# Altium schematic sheet 4Z.SchDoc
size A4
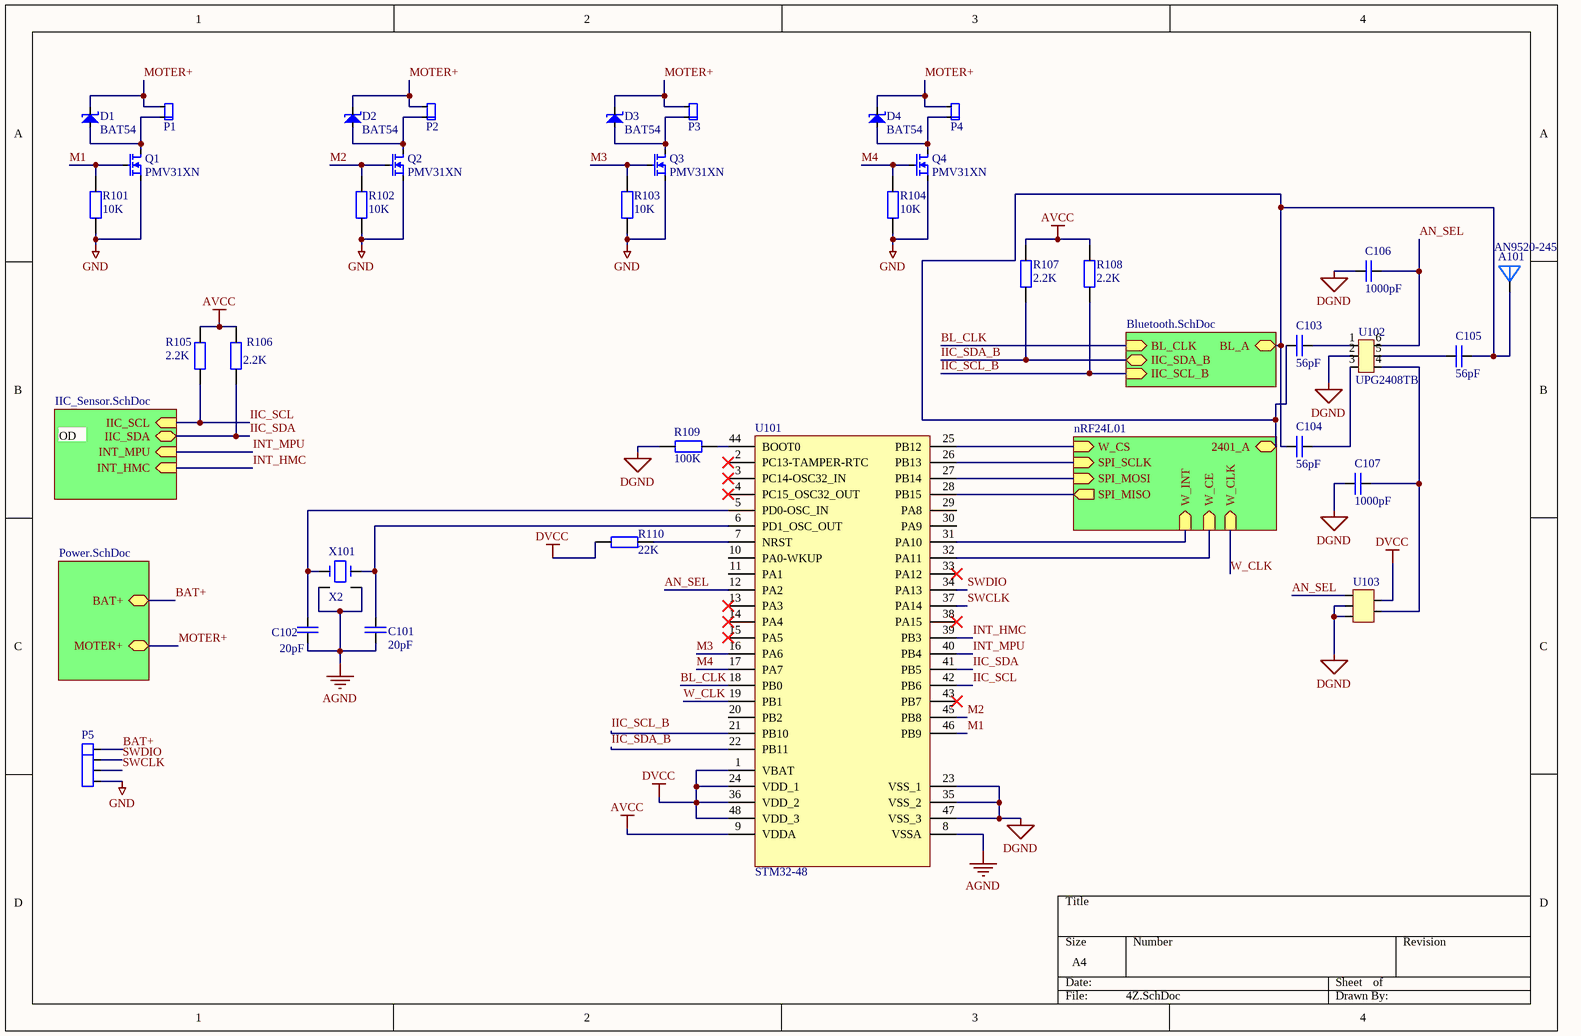
[diagram p0: 4Z.SchDoc]

## Parts
A101  AN9520-245  [AN9520-245]
C101  20pF  [0603]
C102  20pF  [0603]
C103  56pF  [0603]
C104  56pF  [0603]
C105  56pF  [0603]
C106  1000pF  [0603]
C107  1000pF  [0603]
D1  BAT54  [BAT54]
D2  BAT54  [BAT54]
D3  BAT54  [BAT54]
D4  BAT54  [BAT54]
P1  DIP_2  [PAD_M]  (value not drawn)
P2  DIP_2  [PAD_M]  (value not drawn)
P3  DIP_2  [PAD_M]  (value not drawn)
P4  DIP_2  [PAD_M]  (value not drawn)
P5  DIP_4  [DIP_4]  (value not drawn)
Q1  PMV31XN  [PMV31XN]
Q2  PMV31XN  [PMV31XN]
Q3  PMV31XN  [PMV31XN]
Q4  PMV31XN  [PMV31XN]
R101  10K  [0603]
R102  10K  [0603]
R103  10K  [0603]
R104  10K  [0603]
R105  2.2K  [0603]
R106  2.2K  [0603]
R107  2.2K  [0603]
R108  2.2K  [0603]
R109  100K  [0603]
R110  22K  [0603]
U101  STM32-48  [STM32-48]
U102  UPG2408TB  [UPF2408TB]
U103  SN74LVC1G02DBVR  [SN74LVC1G02DBVR]  (value not drawn)
X101  X2  [3225]

## Sub-sheets
Bluetooth = Bluetooth.SchDoc: IIC_SCL_B (in), IIC_SDA_B (bidir), BL_CLK (in), BL_A
IIC_Sensor = IIC_Sensor.SchDoc: IIC_SCL (in), IIC_SDA (bidir), INT_MPU (in), INT_HMC (in)
nRF24L01 = nRF24L01: W_CE (in), W_CS (in), W_CLK (in), SPI_SCLK (in), SPI_MOSI (in), SPI_MISO (out), 2401_A, W_INT (in)
Power = Power.SchDoc: BAT+, MOTER+

## Nets
AGND: C101.1 C102.1 U101.8(VSSA) X101.2 X101.4
AVCC: R105.1 R106.1 R107.1 R108.1 U101.9(VDDA)
DGND: C106.2 C107.2 R109.2 U101.23(VSS_1) U101.35(VSS_2) U101.47(VSS_3) U102.2(GND) U103.2(IN) U103.3(GND)
DVCC: R110.2 U101.1(VBAT) U101.24(VDD_1) U101.36(VDD_2) U101.48(VDD_3) U103.4(VCC)
GND: P5.4 Q1.2 Q2.2 Q3.2 Q4.2 R101.2 R102.2 R103.2 R104.2
AN_SEL: C106.1 U101.12(PA2) U102.6(V1) U103.1(IN)
BAT+: P5.1 ; sheet Power/BAT+
BL_CLK: U101.18(PB0) ; sheet Bluetooth/BL_CLK
IIC_SCL: R105.2 U101.42(PB6) ; sheet IIC_Sensor/IIC_SCL
IIC_SCL_B: R108.2 U101.21(PB10) ; sheet Bluetooth/IIC_SCL_B
IIC_SDA: R106.2 U101.41(PB5) ; sheet IIC_Sensor/IIC_SDA
IIC_SDA_B: R107.2 U101.22(PB11) ; sheet Bluetooth/IIC_SDA_B
INT_HMC: U101.39(PB3) ; sheet IIC_Sensor/INT_HMC
INT_MPU: U101.40(PB4) ; sheet IIC_Sensor/INT_MPU
M1: Q1.1 R101.1 U101.46(PB9)
M2: Q2.1 R102.1 U101.45(PB8)
M3: Q3.1 R103.1 U101.16(PA6)
M4: Q4.1 R104.1 U101.17(PA7)
MOTER+: D1.3 D2.3 D3.3 D4.3 P1.2 P2.2 P3.2 P4.2 ; sheet Power/MOTER+
SWCLK: P5.3 U101.37(PA14)
SWDIO: P5.2 U101.34(PA13)
W_CLK: U101.19(PB1) ; sheet nRF24L01/W_CLK
NetA101_1: A101.1 C103.1 C104.1 C105.2 ; sheet nRF24L01/2401_A, sheet Bluetooth/BL_A
NetC101_2: C101.2 U101.6(PD1_OSC_OUT) X101.1
NetC102_2: C102.2 U101.5(PD0-OSC_IN) X101.3
NetC103_2: C103.2 U102.1(RF1)
NetC104_2: C104.2 U102.3(RF2)
NetC105_1: C105.1 U102.5(RFC)
NetC107_1: C107.1 U102.4(V2) U103.5(OUT)
NetD1_1: D1.1 P1.1 Q1.3
NetD2_1: D2.1 P2.1 Q2.3
NetD3_1: D3.1 P3.1 Q3.3
NetD4_1: D4.1 P4.1 Q4.3
NetR109_1: R109.1 U101.44(BOOT0)
NetR110_1: R110.1 U101.7(NRST)
NetU101_25: U101.25(PB12) ; sheet nRF24L01/W_CS
NetU101_26: U101.26(PB13) ; sheet nRF24L01/SPI_SCLK
NetU101_27: U101.27(PB14) ; sheet nRF24L01/SPI_MOSI
NetU101_28: U101.28(PB15) ; sheet nRF24L01/SPI_MISO
NetU101_31: U101.31(PA10) ; sheet nRF24L01/W_INT
NetU101_32: U101.32(PA11) ; sheet nRF24L01/W_CE

Not connected (* = marked no-connect by the designer): U101 2(PC13-TAMPER-RTC)* 3(PC14-OSC32_IN)* 4(PC15_OSC32_OUT)* 10(PA0-WKUP) 11(PA1) 13(PA3)* 14(PA4)* 15(PA5)* 20(PB2) 29(PA8) 30(PA9) 33(PA12)* 38(PA15)* 43(PB7)*

## Notes on the sheet
- OD

## Library data of the parts
A101 = AN9520-245: antenna
C101-C107 = C0603
R101-R110 = R0603
X101 = X2: 3225